# Altium schematic sheet Duang60v2.SchDoc
size A4
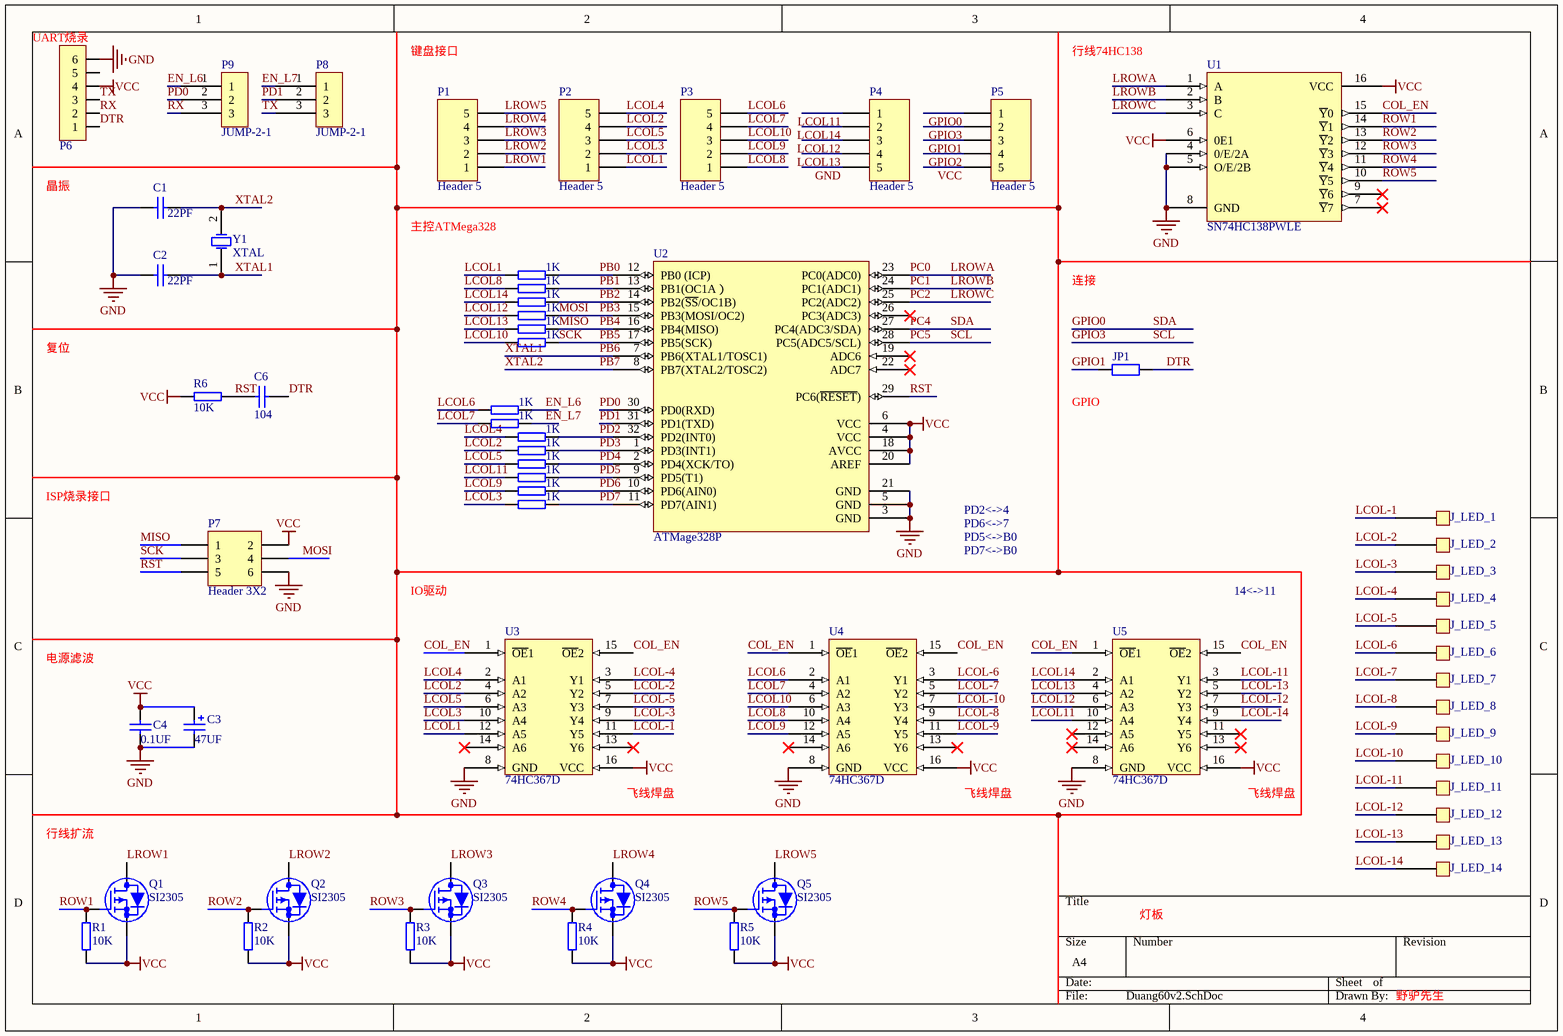
[diagram p0: Duang60v2.SchDoc]

## Parts
C1  value 22PF  [c0805]  (hidden comment: Cap Semi)
C2  value 22PF  [c0805]  (hidden comment: Cap Semi)
C3  value 47UF  [CAPT3216]  (hidden comment: Cap Pol2)
C4  value 0.1UF  [c0805]  (hidden comment: Cap Semi)
C6  104  [c0805]
J_LED_1  JUMP1  [焊盘]  (value not drawn)
J_LED_2  JUMP1  [焊盘]  (value not drawn)
J_LED_3  JUMP1  [焊盘]  (value not drawn)
J_LED_4  JUMP1  [焊盘]  (value not drawn)
J_LED_5  JUMP1  [焊盘]  (value not drawn)
J_LED_6  JUMP1  [焊盘]  (value not drawn)
J_LED_7  JUMP1  [焊盘]  (value not drawn)
J_LED_8  JUMP1  [焊盘]  (value not drawn)
J_LED_9  JUMP1  [焊盘]  (value not drawn)
J_LED_10  JUMP1  [焊盘]  (value not drawn)
J_LED_11  JUMP1  [焊盘]  (value not drawn)
J_LED_12  JUMP1  [焊盘]  (value not drawn)
J_LED_13  JUMP1  [焊盘]  (value not drawn)
J_LED_14  JUMP1  [焊盘]  (value not drawn)
JP1  0  [c0805]  (value not drawn)
P1  Header 5  [HDR1X5]
P2  Header 5  [HDR1X5]
P3  Header 5  [HDR1X5]
P4  Header 5  [HDR1X5]
P5  Header 5  [HDR1X5]
P6  HDR1X6_180_2.54  [HDR1X6_180_2.54]  (value not drawn)
P7  Header 3X2  [HDR2X3]
P8  JUMP-2-1  [JUMP-2-1]
P9  JUMP-2-1  [JUMP-2-1]
Q1  SI2305  [si2312]
Q2  SI2305  [si2312]
Q3  SI2305  [si2312]
Q4  SI2305  [si2312]
Q5  SI2305  [si2312]
R1  10K  [r0806]
R2  10K  [r0806]
R3  10K  [r0806]
R4  10K  [r0806]
R5  10K  [r0806]
R6  10K  [r0806]
R7  1k  [JP]
R8  1k  [JP]
R9  1k  [JP]
R10  1k  [JP]
R11  1k  [JP]
R12  1k  [JP]
R13  1k  [JP]
R14  1k  [JP]
R15  1k  [JP]
R16  1k  [JP]
R17  1k  [JP]
R18  1k  [JP]
R19  1k  [JP]
R20  1k  [JP]
U1  SN74HC138PWLE  [TSSOP_16]
U2  ATMage328P  [TQFP_32]
U3  74HC367D  [SOIC16]
U4  74HC367D  [SOIC16]
U5  74HC367D  [SOIC16]
Y1  XTAL  [XTAL_DIP]

## Nets
GND: C1.2 C2.2 C3.2 C4.1 P4.5 P6.6 P7.6 U1.4(0/E/2A) U1.5(O/E/2B) U1.8(GND) U2.3(GND) U2.5(GND) U2.21(GND) U3.8(GND) U4.8(GND) U5.8(GND)
VCC: C3.1 C4.2 P5.5 P6.4 P7.2 Q1.3(S) Q2.3(S) Q3.3(S) Q4.3(S) Q5.3(S) R1.1 R2.1 R3.1 R4.1 R5.1 R6.2 U1.6(0E1) U1.16(VCC) U2.4(VCC) U2.6(VCC) U2.18(AVCC) U2.20(AREF) U3.16(VCC) U4.16(VCC) U5.16(VCC)
COL_EN: U1.15(~{Y}0) U3.1(~{OE}1) U3.15(~{OE}2) U4.1(~{OE}1) U4.15(~{OE}2) U5.1(~{OE}1) U5.15(~{OE}2)
DTR: C6.2 JP1.2 P6.1
EN_L6: P9.1 R12.2
EN_L7: P8.1 R13.2
GPIO0: P5.1 U2.27(PC4(ADC3/SDA))  [also labelled PC4, SDA]
GPIO1: JP1.1 P5.3
GPIO2: P5.4
GPIO3: P5.2 U2.28(PC5(ADC5/SCL))  [also labelled PC5, SCL]
LCOL1: P2.1 R9.1 U3.12(A5)
LCOL2: P2.4 R8.1 U3.4(A2)
LCOL3: P2.2 R7.1 U3.10(A4)
LCOL4: P2.5 R10.1 U3.2(A1)
LCOL5: P2.3 R11.1 U3.6(A3)
LCOL6: P3.5 R12.1 U4.2(A1)
LCOL7: P3.4 R13.1 U4.4(A2)
LCOL8: P3.1 R14.1 U4.10(A4)
LCOL9: P3.2 R15.1 U4.12(A5)
LCOL10: P3.3 R16.1 U4.6(A3)
LCOL11: P4.1 R20.1 U5.10(A4)
LCOL12: P4.3 R18.1 U5.6(A3)
LCOL13: P4.4 R19.1 U5.4(A2)
LCOL14: P4.2 R17.1 U5.2(A1)
LCOL-1: J_LED_1.1 U3.11(Y5)
LCOL-2: J_LED_2.1 U3.5(Y2)
LCOL-3: J_LED_3.1 U3.9(Y4)
LCOL-4: J_LED_4.1 U3.3(Y1)
LCOL-5: J_LED_5.1 U3.7(Y3)
LCOL-6: J_LED_6.1 U4.3(Y1)
LCOL-7: J_LED_7.1 U4.5(Y2)
LCOL-8: J_LED_8.1 U4.9(Y4)
LCOL-9: J_LED_9.1 U4.11(Y5)
LCOL-10: J_LED_10.1 U4.7(Y3)
LCOL-11: J_LED_11.1 U5.3(Y1)
LCOL-12: J_LED_12.1 U5.7(Y3)
LCOL-13: J_LED_13.1 U5.5(Y2)
LCOL-14: J_LED_14.1 U5.9(Y4)
LROW1: P1.1 Q1.2(D)
LROW2: P1.2 Q2.2(D)
LROW3: P1.3 Q3.2(D)
LROW4: P1.4 Q4.2(D)
LROW5: P1.5 Q5.2(D)
LROWA: U1.1(A) U2.23(PC0(ADC0))  [also labelled PC0]
LROWB: U1.2(B) U2.24(PC1(ADC1))  [also labelled PC1]
LROWC: U1.3(C) U2.25(PC2(ADC2))  [also labelled PC2]
MISO: P7.1 R19.2 U2.16(PB4(MISO))  [also labelled PB4]
MOSI: P7.4 R18.2 U2.15(PB3(MOSI/OC2))  [also labelled PB3]
PB0: R9.2 U2.12(PB0_(ICP))
PB1: R14.2 U2.13(PB1(OC1A）)
PB2: R17.2 U2.14(PB2(~{SS}/OC1B))
PB5: P7.3 R16.2 U2.17(PB5(SCK))  [also labelled SCK]
PB6: C2.1 U2.7(PB6(XTAL1/TOSC1)) Y1.1(OSC1)  [also labelled XTAL1]
PB7: C1.1 U2.8(PB7(XTAL2/TOSC2)) Y1.2(OSC2)  [also labelled XTAL2]
PD0: P9.2 U2.30(PD0(RXD))
PD1: P8.2 U2.31(PD1(TXD))
PD2: R10.2 U2.32(PD2(INT0))
PD3: R8.2 U2.1(PD3(INT1))
PD4: R11.2 U2.2(PD4(XCK/TO))
PD5: R20.2 U2.9(PD5(T1))
PD6: R15.2 U2.10(PD6(AIN0))
PD7: R7.2 U2.11(PD7(AIN1))
ROW1: Q1.1(G) R1.2 U1.14(~{Y}1)
ROW2: Q2.1(G) R2.2 U1.13(~{Y}2)
ROW3: Q3.1(G) R3.2 U1.12(~{Y}3)
ROW4: Q4.1(G) R4.2 U1.11(~{Y}4)
ROW5: Q5.1(G) R5.2 U1.10(~{Y}5)
RST: C6.1 P7.5 R6.1 U2.29(PC6(~{RESET}))
RX: P6.2 P9.3
TX: P6.3 P8.3

Not connected (* = marked no-connect by the designer): P6 5; U1 7(~{Y}7)* 9(~{Y}6)*; U2 19(ADC6)* 22(ADC7)* 26(PC3(ADC3))*; U3 13(Y6)* 14(A6)*; U4 13(Y6)* 14(A6)*; U5 11(Y5)* 12(A5)* 13(Y6)* 14(A6)*

## Notes on the sheet
- (near P6) UART烧录
- 键盘接口
- 行线74HC138
- 晶振
- 主控ATMega328
- 连接
- 复位
- (near JP1) GPIO
- ISP烧录接口
- PD2<->4
- PD6<->7
- PD5<->B0
- PD7<->B0
- IO驱动
- 14<->11
- 电源滤波
- 行线扩流
- (near U3) 飞线焊盘
- (near U4) 飞线焊盘
- (near U5) 飞线焊盘
- 灯板
- 野驴先生

## Library data of the parts
C1 C2 C4 = Cap Semi: Capacitor (Semiconductor SIM Model); Published: 8-Jun-2000; LatestRevisionDate: 17-Jul-2002; LatestRevisionNote: Re-released for DXP Platform.; PackageReference: C1206; Publisher: Altium Limited
C3 = Cap Pol2: Polarized Capacitor (Axial); Published: 8-Jun-2000; LatestRevisionDate: 17-Jul-2002; LatestRevisionNote: Re-released for DXP Platform.; PackageReference: POLAR0.8; Publisher: Altium Limited
C6 = Cap Chip 2: Chip Capacitor, Silkscreen Border; Voltage: 63V; Tolerance: Y5V; Published: 8-Jun-2000; Revision: July-2002: Re-released for DXP Platform.; Publisher: Altium Limited; Price(RMB): 0.000; Value: 104
JP1 = Res_0805: Resistor
P1-P5 = Header 5: Header, 5-Pin; LatestRevisionDate: 17-Jul-2002; LatestRevisionNote: Re-released for DXP Platform.; Publisher: Altium Limited
P6 = HDR1X6_180_2.54: Header
P7 = Header 3X2: Header, 3-Pin, Dual row; LatestRevisionDate: 17-Jul-2002; LatestRevisionNote: Re-released for DXP Platform.; Publisher: Altium Limited
Q1-Q5 = MOSFET-P: P-Channel MOSFET; Published: 8-Jun-2000; Revision: July-2002: Re-released for DXP Platform.; Publisher: Altium Limited; Price(RMB): 0.000; PartNumber: SI2305
R1-R20 = Res Chip 2p 2: Chip Resistor, Border Silkscreen On PCB Library; Tolerance: 5%; Published: 8-Jun-2000; Revision: July-2002: Re-released for DXP Platform.; Publisher: Altium Limited; Price(RMB): 0.000
  R1-R6: Value: 10K
  R7-R20: Value: 1K
Y1 = XTAL: Crystal Oscillator; Published: 8-Jun-2000; LatestRevisionDate: 17-Jul-2002; LatestRevisionNote: Re-released for DXP Platform.; PackageReference: R38; Publisher: Altium Limited